# EAGLE schematic LCD_8bit (EAGLE 9.3.1)
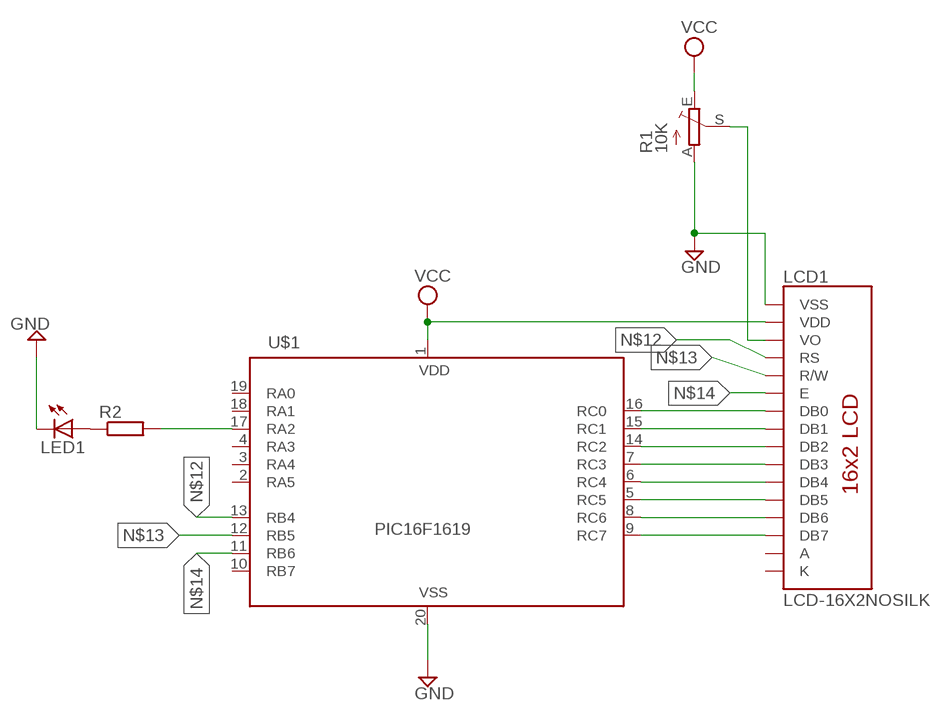
[diagram p0: schematic, sheet 1]

## Parts
LCD1  LCD-16X2NOSILK  [LCD-16X2_NOSILK]
LED1  LEDB155  [Q62902-B155]
R1  10K  TRIM_EU-B25P  [B25P]
R2  R-EU_0309/V  [0309V]
U$1  PIC16F1619  PIC16F1619-DIP  [DIP20B]

## Nets
GND: LCD1.1(VSS) LED1.K(C) R1.A U$1.20(VSS)
N$1: R2.2 U$1.17(RA2)
N$2: LCD1.3(VO) R1.S
N$3: LCD1.10(DB3) U$1.7(RC3)
N$4: LCD1.11(DB4) U$1.6(RC4)
N$5: LCD1.12(DB5) U$1.5(RC5)
N$6: LCD1.7(DB0) U$1.16(RC0)
N$7: LCD1.13(DB6) U$1.8(RC6)
N$8: LCD1.14(DB7) U$1.9(RC7)
N$12: LCD1.4(RS) U$1.13(RB4)
N$13: LCD1.5(R/W) U$1.12(RB5)
N$14: LCD1.6(E) U$1.11(RB6)
N$17: LED1.A R2.1
N$18: LCD1.8(DB1) U$1.15(RC1)
N$19: LCD1.9(DB2) U$1.14(RC2)
VCC: LCD1.2(VDD) R1.E U$1.1(VDD)
Unconnected: U$1.2(RA5) U$1.3(RA4) U$1.4(RA3) U$1.10(RB7) U$1.18(RA1) U$1.19(RA0)

## Power pins joined to a net without a drawn wire
A: LCD1.15(A)
K: LCD1.16(K)

## Library data of the parts
LCD1 = SparkFun-Displays:LCD-16X2: Standard text-only 16x2 parallel input LCD Basic 16 character by 2 line display. Typically utilizes the extremely common HD44780 parallel interface chipset SparkFun Products: Basic 16x2 Green <https://www.sparkfun.com/products/255> Basic 8x2 Green <https://www.sparkfun.com/products/11122>; SF_ID: LCD-00255
LED1 = adafruit:LED: LED OSRAM: - CHIPLED LG R971, LG N971, LY N971, LG Q971, LY Q971, LO R971, LY R971 LH N974, LH R974 LS Q976, LO Q976, LY Q976 LO Q996 - Hyper CHIPLED LW Q18S LB Q993, LB Q99A, LB R99A - SideLED LS A670, LO A670, LY A670, LG A670, LP A670 LB A673, LV A673, LT A673, LW A673 LH A674 LY A675 LS A676, LA A676, LO A676, LY A676, LW A676 LS A679, LY A679, LG A679 - Hyper Micro SIDELED® LS Y876, LA Y876, LO Y876, LY Y876 LT Y87S - SmartLED LW L88C, LW L88S LB L89C, LB L89S, LG L890 LS L89K, LO L89K, LY L89K LS L896, LA L896, LO L896, LY L896 - TOPLED LS T670, LO T670, LY T670, LG T670, LP T670 LSG T670, LSP T670, LSY T670, LOP T670, LYG T670 LG T671, LOG T671, LSG T671 LB T673, LV T673, LT T673, LW T673 LH T674 LS T676, LA T676, LO T676, LY T676, LB T676, LH T676, LSB T676, LW T676 LB T67C, LV T67C, LT T67C, LS T67K, LO T67K, LY T67K, LW E67C LS E67B, LA E67B, LO E67B, LY E67B, LB E67C, LV E67C, LT E67C LW T67C LS T679, LY T679, LG T679 LS T770, LO T770, LY T770, LG T770, LP T770 LB T773, LV T773, LT T773, LW T773 LH T774 LS E675, LA E675, LY E675, LS T675 LS T776, LA T776, LO T776, LY T776, LB T776 LHGB T686 LT T68C, LB T68C - Hyper Mini TOPLED® LB M676 - Mini TOPLED Santana® LG M470 LS M47K, LO M47K, LY M47K Source: http://www.osram.convergy.de/
R1 = pot:TRIM_EU-: POTENTIOMETER
R2 = rcl:R-EU_: RESISTOR, European symbol; SPICEPREFIX: R
U$1 = PIC-parts:PIC16F1619-DIP: PIC 16F1619 20 pin DIP